# EAGLE schematic ESP8266_Weather_Station_With_BME280 (EAGLE 8.3.1)
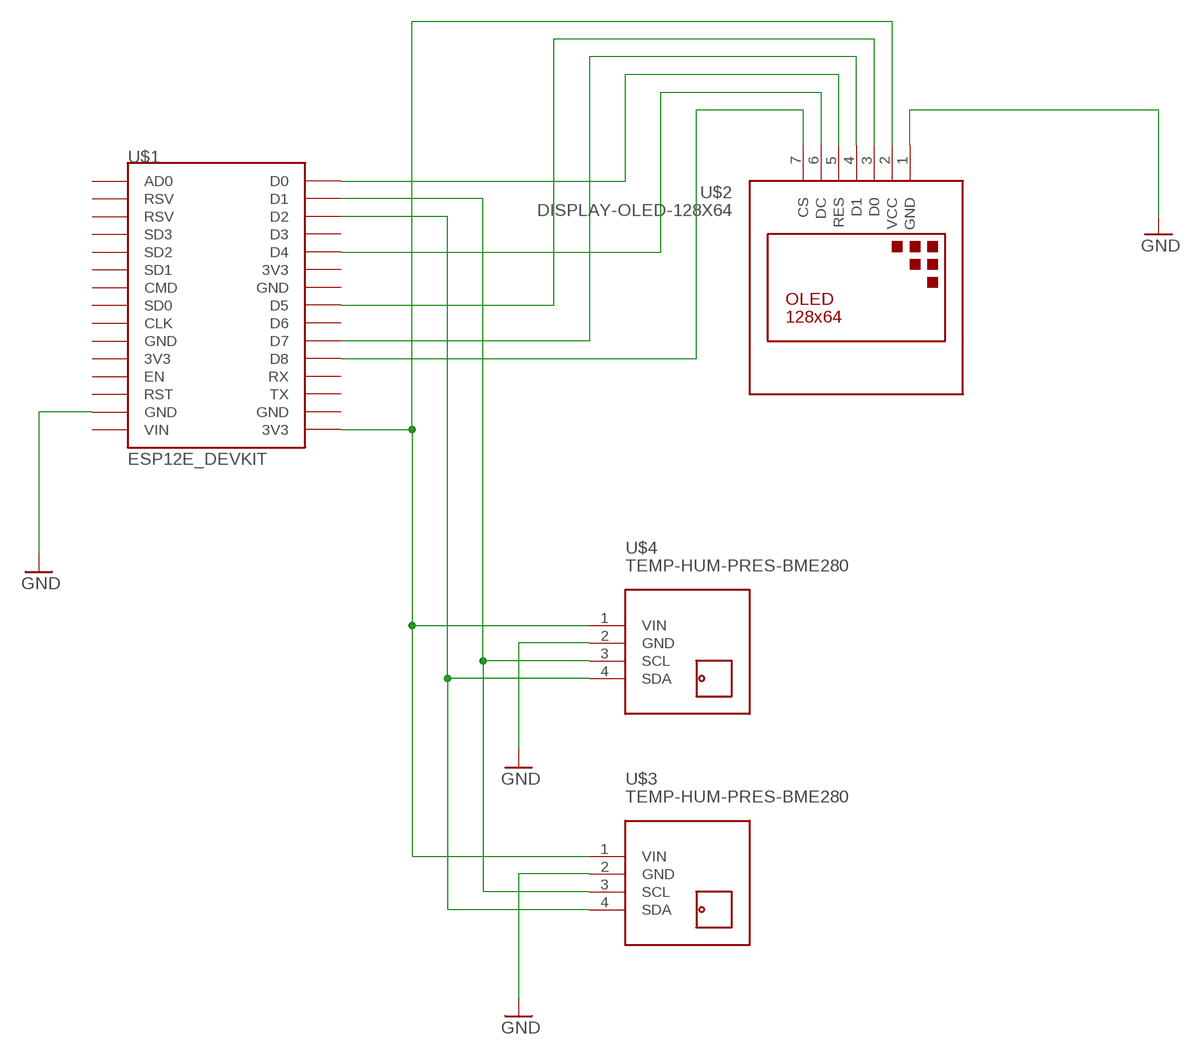
[diagram p0: schematic, sheet 1]

## Parts
U$1  ESP12E_DEVKIT  [ESP12E_DEVKIT]
U$2  DISPLAY-OLED-128X64  [DISPLAY-OLED-128X64]
U$3  TEMP-HUM-PRES-BME280  [TEMP-HUM-PRES-BME280]
U$4  TEMP-HUM-PRES-BME280  [TEMP-HUM-PRES-BME280]

## Nets
GND: U$1.GND@1(GND) U$2.1(GND) U$3.2(GND)
N$1: U$1.D1 U$3.3(SCL) U$4.3(SCL)
N$2: U$1.D2 U$3.4(SDA) U$4.4(SDA)
N$3: U$1.3V3@2(3V3) U$2.2(VCC) U$3.1(VIN) U$4.1(VIN)
N$4: U$1.D8 U$2.7(CS)
N$5: U$1.D4 U$2.6(DC)
N$6: U$1.D0 U$2.5(RES)
N$7: U$1.D7 U$2.4(D1)
N$8: U$1.D5 U$2.3(D0)
Unconnected: U$1.3V3@0(3V3) U$1.3V3@1(3V3) U$1.AD0 U$1.CLK U$1.CMD U$1.D3 U$1.D6 U$1.EN U$1.GND@0(GND) U$1.GND@2(GND) U$1.GND@3(GND) U$1.RST U$1.RSV@0(RSV) U$1.RSV@1(RSV) U$1.RX U$1.SD0 U$1.SD1 U$1.SD2 U$1.SD3 U$1.TX U$1.VIN

## Power pins joined to a net without a drawn wire
GND: U$4.2(GND)

## Library data of the parts
U$1 = ESP12E_DEVKIT:ESP12E_DEVKIT: ESP12E DEVKIT BOARD
U$2 = diy-modules:DISPLAY-OLED-128X64: 128x64 Dot Matrix OLED Module based on SSD1306 chip Variant with SPI interface More details available here: http://www.instructables.com/id/How-to-use-OLED-display-arduino-module/ SSD1306 datasheet: https://cdn-shop.adafruit.com/datasheets/SSD1306.pdf Click here to find device on ebay.com <http://www.ebay.com/sch/oled+display+128x64> Note: There are two variants: I2C and SPI. Search for the proper version.
U$3 U$4 = diy-modules:TEMP-HUM-PRES-BME280: Digital Humidity-Temperature-Pressure Sensor based on BME280 device More information about BME280 device is available here: https://www.bosch-sensortec.com/bst/products/all_products/bme280 Click here to find device on ebay.com <http://www.ebay.com/sch/bme280+breakout>